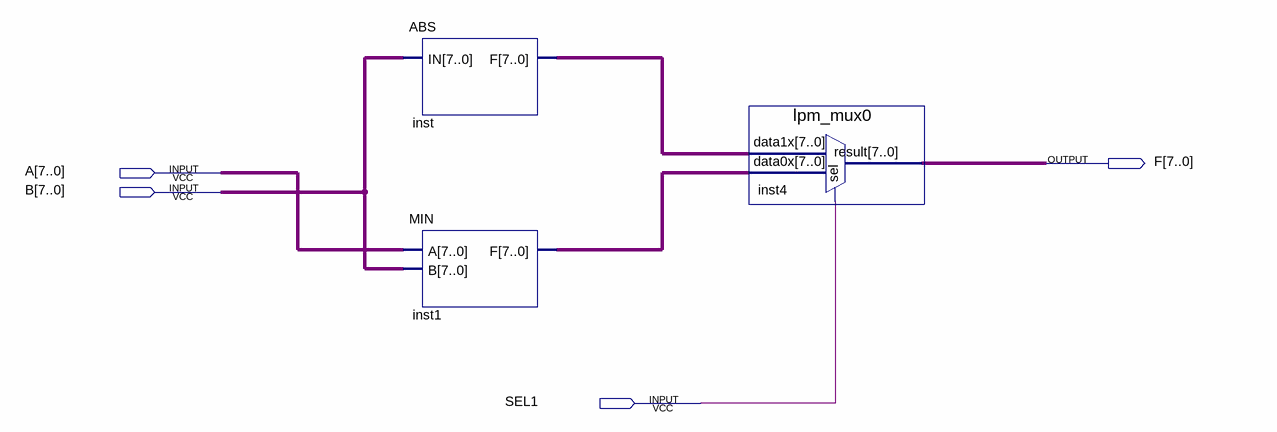
[diagram p0: schematic sheet]
// Quartus schematic ALU2.bdf as structural Verilog: 3 symbols, 4 pins
module ALU2 (
  input  [7:0] A,
  input  [7:0] B,
  input  SEL1,
  output [7:0] F
);

  wire [7:0] inst1_f, inst_f;

  ABS inst (.IN(B), .F(inst_f));
  MIN inst1 (.A(A), .B(B), .F(inst1_f));
  lpm_mux0 inst4 (.data1x(inst_f), .data0x(inst1_f), .sel(SEL1), .result(F));
endmodule
